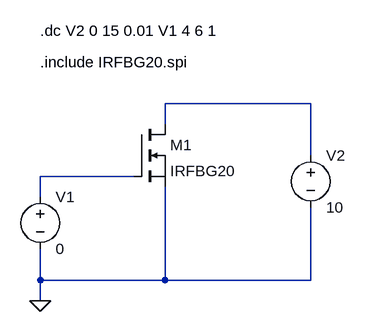
[diagram p0: schematic test.asc]
test.asc, the LTspice schematic file:
Version 4
SHEET 1 1512 988
WIRE -448 272 -448 240
WIRE -448 400 -448 352
WIRE -448 432 -448 400
WIRE -304 240 -448 240
WIRE -256 160 -256 128
WIRE -256 400 -448 400
WIRE -256 400 -256 256
WIRE -32 128 -256 128
WIRE -32 208 -32 128
WIRE -32 400 -256 400
WIRE -32 400 -32 288
FLAG -448 432 0
SYMBOL voltage -448 256 R0
SYMATTR InstName V1
SYMATTR Value 0
SYMBOL voltage -32 192 R0
SYMATTR InstName V2
SYMATTR Value 10
SYMBOL nmos -304 160 R0
SYMATTR InstName M1
SYMATTR Value IRFBG20
SYMATTR Prefix X
TEXT -448 16 Left 0 !.dc V2 0 15 0.01 V1 4 6 1
TEXT -448 64 Left 0 !.include IRFBG20.spi

The netlist it stands for:
* test.asc
V1 N001 0 0
V2 N002 0 10
XM1 N002 N001 0 IRFBG20  ; pins D G S
.dc V2 0 15 0.01 V1 4 6 1
.include IRFBG20.spi
.backanno
.end